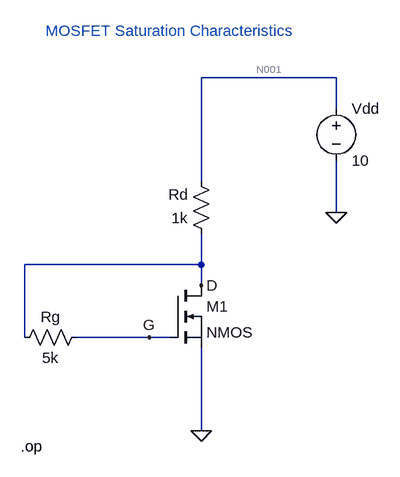
[diagram p0: schematic MOSFET Saturation Characteristics.asc]
MOSFET Saturation Characteristics.asc, the LTspice schematic file:
Version 4
SHEET 1 880 680
WIRE 496 -160 288 -160
WIRE 496 -112 496 -160
WIRE 288 0 288 -160
WIRE 496 48 496 -32
WIRE 288 128 288 80
WIRE 288 128 16 128
WIRE 288 160 288 128
WIRE 16 240 16 128
WIRE 208 240 96 240
WIRE 240 240 208 240
WIRE 288 384 288 256
FLAG 288 384 0
FLAG 496 48 0
FLAG 208 240 G
FLAG 288 160 D
SYMBOL res 112 224 R90
WINDOW 0 0 56 VBottom 2
WINDOW 3 32 56 VTop 2
SYMATTR InstName Rg
SYMATTR Value 5k
SYMBOL res 304 96 R180
WINDOW 0 36 76 Left 2
WINDOW 3 36 40 Left 2
SYMATTR InstName Rd
SYMATTR Value 1k
SYMBOL nmos 240 160 R0
SYMATTR InstName M1
SYMBOL voltage 496 -128 R0
WINDOW 123 0 0 Left 0
WINDOW 39 0 0 Left 0
SYMATTR InstName Vdd
SYMATTR Value 10
TEXT 10 408 Left 2 !.op
TEXT 48 -232 Left 2 ;MOSFET Saturation Characteristics

The netlist it stands for:
* MOSFET Saturation Characteristics.asc
Rg G D 5k
Rd D N001 1k
M1 D G 0 0 NMOS
Vdd N001 0 10
.model NMOS NMOS
.model PMOS PMOS
.lib standard.mos
.op
* MOSFET Saturation Characteristics
.backanno
.end

* Results of the author's LTspice run, read from the files saved beside the schematic
* Operating Point:
*   V(g) = 9.161 V
*   V(d) = 9.161 V
*   V(n001) = 10 V
*   Id(M1) = 839.2 µA
*   Ig(M1) = 0 A
*   Ib(M1) = -9.171 pA
*   Is(M1) = -839.2 µA
*   I(Rd) = -839.2 µA
*   I(Rg) = 0 A
*   I(Vdd) = -839.2 µA
* From the log:
*   Semiconductor Device Operating Points:
*                           --- MOSFET Transistors ---
*   Name:          m1
*   Model:        nmos
*   Id:          8.39e-04
*   Vgs:         9.16e+00
*   Vds:         9.16e+00
*   Vbs:         0.00e+00
*   Vth:         0.00e+00
*   Vdsat:       9.16e+00
*   Gm:          1.83e-04
*   Gds:         0.00e+00
*   Gmb:         0.00e+00
*   Cbd:         0.00e+00
*   Cbs:         0.00e+00
*   Cgsov:       0.00e+00
*   Cgdov:       0.00e+00
*   Cgbov:       0.00e+00
*   Cgs:         0.00e+00
*   Cgd:         0.00e+00
*   Cgb:         0.00e+00